# Altium schematic sheet 1_Sch.SchDoc
size A4; SheetNumber: 1; SheetTotal: 1
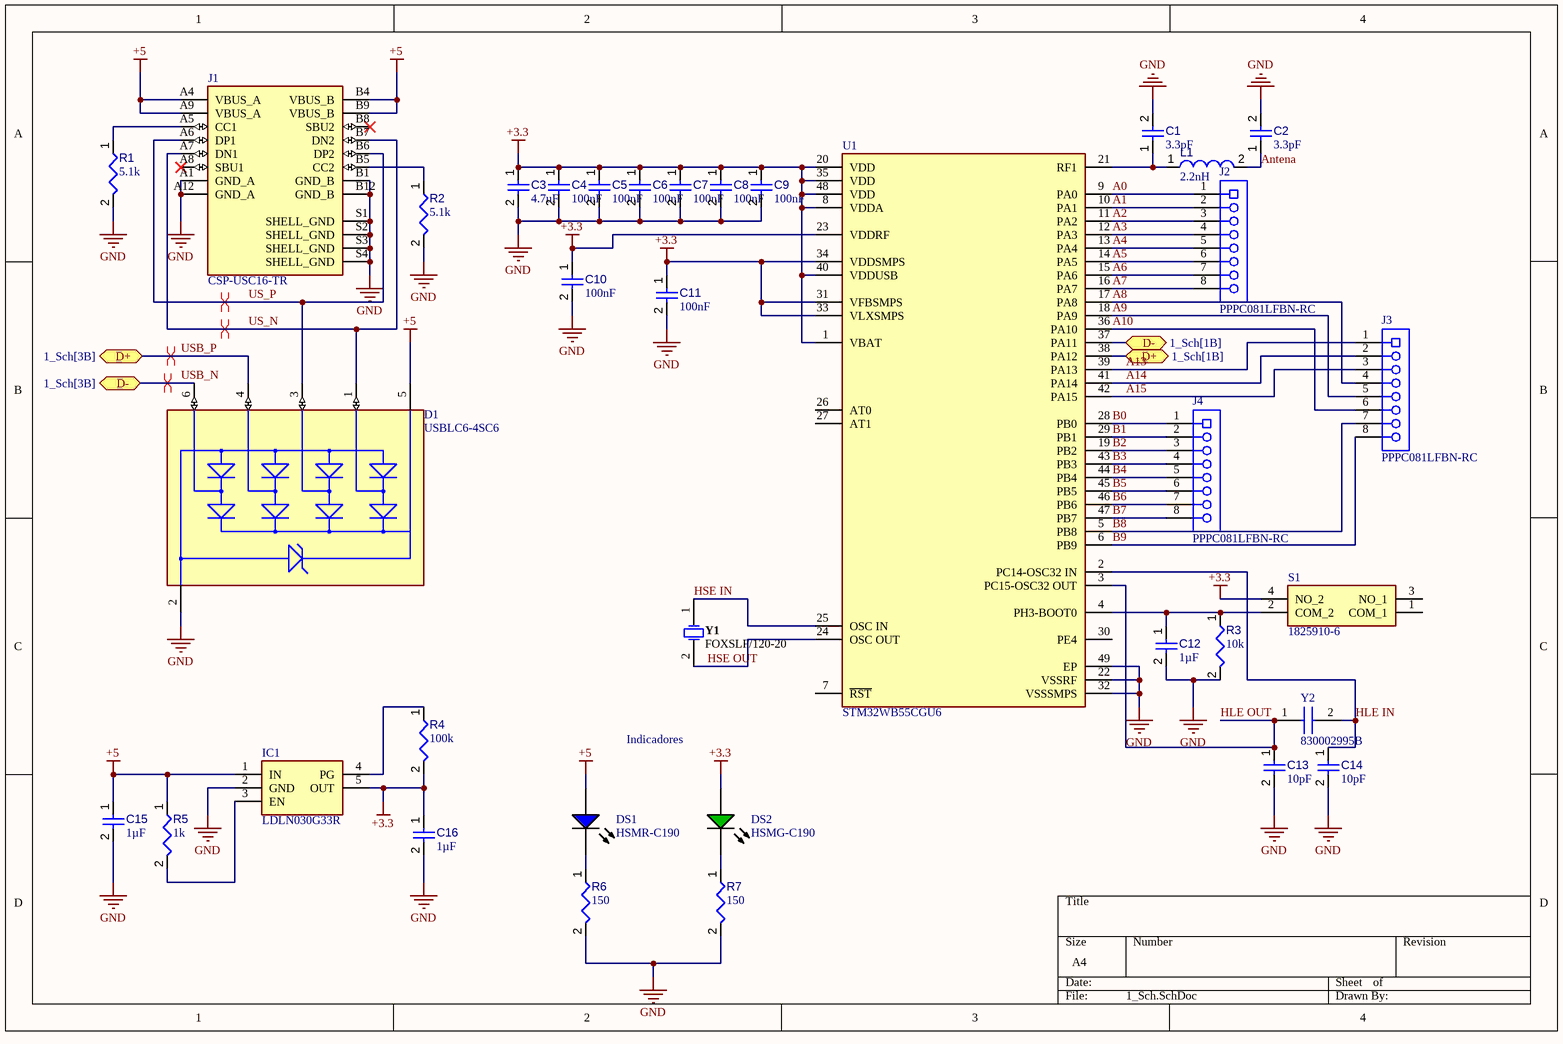
[diagram p0: 1_Sch.SchDoc]

## Parts
C1  value 3.3pF  [CAPC1608X90X40NL10T20]  (hidden comment: Capacitor 100 nF +/-10% 50 V 0603)
C2  value 3.3pF  [CAPC1608X90X40NL10T20]  (hidden comment: Capacitor 100 nF +/-10% 50 V 0603)
C3  value 4.7uF  [CAPC1608X90X40NL10T20]  (hidden comment: Capacitor 100 nF +/-10% 50 V 0603)
C4  value 100nF  [CAPC1608X90X40NL10T20]  (hidden comment: Capacitor 100 nF +/-10% 50 V 0603)
C5  value 100nF  [CAPC1608X90X40NL10T20]  (hidden comment: Capacitor 100 nF +/-10% 50 V 0603)
C6  value 100nF  [CAPC1608X90X40NL10T20]  (hidden comment: Capacitor 100 nF +/-10% 50 V 0603)
C7  value 100nF  [CAPC1608X90X40NL10T20]  (hidden comment: Capacitor 100 nF +/-10% 50 V 0603)
C8  value 100nF  [CAPC1608X90X40NL10T20]  (hidden comment: Capacitor 100 nF +/-10% 50 V 0603)
C9  value 100nF  [CAPC1608X90X40NL10T20]  (hidden comment: Capacitor 100 nF +/-10% 50 V 0603)
C10  value 100nF  [CAPC1608X90X40NL10T20]  (hidden comment: Capacitor 100 nF +/-10% 50 V 0603)
C11  value 100nF  [CAPC1608X90X40NL10T20]  (hidden comment: Capacitor 100 nF +/-10% 50 V 0603)
C12  value 1µF  [CAPC1608X94X35NL15T15]  (hidden comment: Capacitor 1 uF +/- 10% 16 V 0603)
C13  value 10pF  [CAPC1608X90X40ML10T20]  (hidden comment: Capacitor 10 pF +/- 5% 50 V 0603)
C14  value 10pF  [CAPC1608X90X40ML10T20]  (hidden comment: Capacitor 10 pF +/- 5% 50 V 0603)
C15  value 1µF  [CAPC1608X90X35ML15T15]  (hidden comment: Capacitor 1uF +/- 10% 16V 0603)
C16  value 1µF  [CAPC1608X90X35ML15T15]  (hidden comment: Capacitor 1uF +/- 10% 16V 0603)
D1  USBLC6-4SC6  [FP-SOT23-6L-MFG]
DS1  HSMR-C190  [AVAG-HSMX-C190_V]
DS2  HSMG-C190  [AVAG-HSMX-C190_V]
IC1  LDLN030G33R  [SOT95P280X100-5N]
J1  CSP-USC16-TR  [VALCON_CSP-USC16-TR]
J2  PPPC081LFBN-RC  [SLIN-PPPC081LFBN-RC_V]
J3  PPPC081LFBN-RC  [SLIN-PPPC081LFBN-RC_V]
J4  PPPC081LFBN-RC  [SLIN-PPPC081LFBN-RC_V]
L1  value 2.2nH  [IND1005X55X20VL5T10]  (hidden comment: ELJ-RF2N2DFB)
R1  value 5.1k  [RESC1608X55X25ML10T15]  (hidden comment: Resistor 1k +/-1% 0603 100 mW)
R2  value 5.1k  [RESC1608X55X25ML10T15]  (hidden comment: Resistor 1k +/-1% 0603 100 mW)
R3  value 10k  [RESC1608X55X25ML10T15]  (hidden comment: Resistor 10k +/-1% 0603 100 mW)
R4  value 100k  [RESC1608X55X25ML10T15]  (hidden comment: Resistor 100k +/-1% 0603 100 mW)
R5  value 1k  [RESC1608X55X25ML10T15]  (hidden comment: Resistor 1k +/-1% 0603 100 mW)
R6  value 150  [RESC1608X55X25ML10T15]  (hidden comment: Resistor 1k +/-1% 0603 100 mW)
R7  value 150  [RESC1608X55X25ML10T15]  (hidden comment: Resistor 1k +/-1% 0603 100 mW)
S1  1825910-6  [18259106]
U1  STM32WB55CGU6  [FP-STM32WB55CGU6-MFG]
Y1  FOXSLF/120-20  [FOX-FOXSLF-2_V]
Y2  830002995B  [830002995B]

## Ports
D+ (bidir, see 1_Sch[1B]), D+ (bidir, see 1_Sch[3B]), D- (bidir, see 1_Sch[1B]), D- (bidir, see 1_Sch[3B])

## Nets
+3.3: C3.1 C4.1 C5.1 C6.1 C7.1 C8.1 C9.1 C10.1 C11.1 C16.1 DS2.1(A) IC1.5(OUT) R4.2 S1.4(NO_2) U1.1(VBAT) U1.8(VDDA) U1.20(VDD) U1.23(VDDRF) U1.31(VFBSMPS) U1.33(VLXSMPS) U1.34(VDDSMPS) U1.35(VDD) U1.40(VDDUSB) U1.48(VDD)
+5: C15.1 D1.5(VBUS) DS1.1(A) IC1.1(IN) J1.A4(VBUS_A) J1.A9(VBUS_A) J1.B4(VBUS_B) J1.B9(VBUS_B) R5.1
GND: C1.2 C2.2 C3.2 C4.2 C5.2 C6.2 C7.2 C8.2 C9.2 C10.2 C11.2 C12.2 C13.2 C14.2 C15.2 C16.2 D1.2(GND) IC1.2(GND) J1.A1(GND_A) J1.A12(GND_A) J1.B1(GND_B) J1.B12(GND_B) J1.S1(SHELL_GND) J1.S2(SHELL_GND) J1.S3(SHELL_GND) J1.S4(SHELL_GND) R1.2 R2.2 R3.2 R6.2 R7.2 U1.22(VSSRF) U1.32(VSSSMPS) U1.49(EP)
A0: J2.1 U1.9(PA0)
A1: J2.2 U1.10(PA1)
A2: J2.3 U1.11(PA2)
A3: J2.4 U1.12(PA3)
A4: J2.5 U1.13(PA4)
A5: J2.6 U1.14(PA5)
A6: J2.7 U1.15(PA6)
A7: J2.8 U1.16(PA7)
A8: J3.4 U1.17(PA8)
A9: J3.5 U1.18(PA9)
A10: J3.6 U1.36(PA10)
A13: J3.1 U1.39(PA13)
A14: J3.2 U1.41(PA14)
A15: J3.3 U1.42(PA15)
Antena: C2.1 L1.2
B0: J4.1 U1.28(PB0)
B1: J4.2 U1.29(PB1)
B2: J4.3 U1.19(PB2)
B3: J4.4 U1.43(PB3)
B4: J4.5 U1.44(PB4)
B5: J4.6 U1.45(PB5)
B6: J4.7 U1.46(PB6)
B7: J4.8 U1.47(PB7)
B8: J3.7 U1.5(PB8)
B9: J3.8 U1.6(PB9)
HLE IN: C14.1 U1.2(PC14-OSC32_IN) Y2.2(CRYSTAL_2)
HLE OUT: C13.1 U1.3(PC15-OSC32_OUT) Y2.1(CRYSTAL_1)
HSE IN: U1.25(OSC_IN) Y1.1
HSE OUT: U1.24(OSC_OUT) Y1.2
US_N: D1.1(I/O1) J1.A7(DN1) J1.B7(DN2)
US_P: D1.3(I/O2) J1.A6(DP1) J1.B6(DP2)
USB_N: D1.6(I/O4) U1.37(PA11) ; port D-
USB_P: D1.4(I/O3) U1.38(PA12) ; port D+
NetC1_1: C1.1 L1.1 U1.21(RF1)
NetC12_1: C12.1 R3.1 S1.2(COM_2) U1.4(PH3-BOOT0)
NetDS1_2: DS1.2(K) R6.1
NetDS2_2: DS2.2(K) R7.1
NetIC1_3: IC1.3(EN) R5.2
NetIC1_4: IC1.4(PG) R4.1
NetJ1_A5: J1.A5(CC1) R1.1
NetJ1_B5: J1.B5(CC2) R2.1

Not connected (* = marked no-connect by the designer): J1 A8(SBU1)* B8(SBU2)*; S1 1(COM_1) 3(NO_1); U1 7(~{RST}) 26(AT0) 27(AT1) 30(PE4)

## Layout directives
differential pair; differential pair class USB: US_N, US_P
differential pair: USB_N, USB_P

## Notes on the sheet
- Indicadores

## Library data of the parts
C1-C11 = CMP-001-00017-6: Chip Capacitor, 100 nF, +/- 10%, 50 V, 0603 (1608 Metric); Voltage Rating: 50V; Capacitor Type: Ceramic; Tolerance: 10%; Mounting Technology: SM; Max Operating Temperature: 125°C; RoHS Compliant: True; Pins: 2; Case/Package: 0603; Min Operating Temperature: -55°C
C12 = CMP-001-00003-6: Chip Capacitor, 1 uF, +/- 10%, 16 V, 0603 (1608 Metric); Voltage Rating: 16V; Capacitor Type: Ceramic; Max Operating Temperature: 125°C; Pins: 2; Tolerance: 10%; Min Operating Temperature: -55°C; RoHS Compliant: True; Mounting Technology: SM; Case/Package: 0603
C13 C14 = CMP-001-00014-6: Chip Capacitor, 10 pF, +/- 5%, 50 V, 0603 (1608 Metric); Capacitor Type: Ceramic; Voltage Rating: 50V; RoHS Compliant: True; Case/Package: 0603; Max Operating Temperature: 125°C; Pins: 2; Tolerance: 5%; Mounting Technology: SM; Min Operating Temperature: -55°C
C15 C16 = CMP-001-00004-6: Chip Capacitor, 1 uF, +/- 10%, 16 V, 0603 (1608 Metric); Capacitor Type: Ceramic; Mounting Technology: SM; RoHS Compliant: True; Min Operating Temperature: -55°C; Case/Package: 0603; Pins: 2; Voltage Rating: 16V; Max Operating Temperature: 125°C; Tolerance: 10%
D1 = CMP-2000-07370-2: TVS DIODE 5.25V 17V SOT23-6; Manufacturer: STMicroelectronics; Peak Pulse Power: 130W; Breakdown Voltage: 6V; Value: 3pF; Direction: Unidirectional; Interface: USB,Ethernet,Other; Number Of Channels: 4; Standoff Height: 0mm; Max Junction Temp: +125°C; Digikey Description: TVS DIODE 5.25V 17V SOT23-6; Automotive: No; Package: SOT23-6L; Mouser Description: USBLC6 Series 4 Line 6 V Uni / Bi-Directional ESD Protection - SOT-23-6; Octopart: https://octopart.com/usblc6-4sc6-stmicroelectronics-347147; RoHS: TRUE; ComponentLink2URL: https://upverter.com/datasheet/23dc4ffb028d868909e80577610284b194f13213.pdf; ComponentLink2Description: Datasheet; Device Class L1: Circuit Protection; Lead Free: Yes; Temperature Range High: +125°C; Device Class L2: ESD and Circuit Protection ICs; Device Class L3: unset; Capacitance: 3pF; Height: 1.45mm; Temperature Range Low: -40°C; Manufacturer Part Number: USBLC6-4SC6; Temperature: -40°C to +125°C; Category: Diode; Clamping Voltage: 17V
DS1 = CMP-007-00015-2: LED Uni-Color Blue, 78 mW, 20 mA, -40 to 85 degC, 2-Pin SMD, RoHS, Tape and Reel; Manufacturer: Avago; Forward Voltage: 3.4V; Power: 78mW; Forward Current: 20mA; Luminous Intensity: 55mcd; Lens Style: Diffused; Viewing Angle: 155degrees; Pins: 2; Max Operating Temperature: 85°C; Colour: Blue; Datasheet Version: Apr-10; RoHS Compliant: True; Mounting Technology: SM; Min Operating Temperature: -40°C; Illumination Colour: Blue; Package Quantity: 4000; Datasheet URL: http://docs.avagotech.com/docs/AV02-0977EN; Package Reference: HSMX-C190; Packaging: TapeandReel; Nominal Vf: 3.4V; Case/Package: 0603; Package Description: 2-Pin Surface Mount Device, Body 1.6 x 0.8 mm, Height 0.9 mm; Manufacturer URL: http://www.avagotech.com/
DS2 = CMP-007-00013-2: LED Uni-Color Green, 52 mW, 20 mA, -40 to 85 degC, 2-Pin SMD, RoHS, Tape and Reel; Manufacturer: Avago; Forward Current: 20mA; Viewing Angle: 170degrees; Luminous Intensity: 15mcd; Lens Style: Diffused; Forward Voltage: 2.2V; Power: 52mW; Mounting Technology: SM; RoHS Compliant: True; Packaging: TapeandReel; Illumination Colour: Green; Datasheet URL: http://docs.avagotech.com/docs/AV02-0551EN; Min Operating Temperature: -40°C; Max Operating Temperature: 85°C; Pins: 2; Package Description: 2-Pin Surface Mount Device, Body 1.6 x 0.8 mm, Height 0.9 mm; Nominal Vf: 2.2V; Case/Package: 0603; Manufacturer URL: http://www.avagotech.com/; Datasheet Version: Mar-12; Colour: Green; Package Reference: HSMX-C190; Package Quantity: 4000
IC1 = LDLN030G33R: Integrated Circuit; Manufacturer_Name: STMicroelectronics; Datasheet Link: https://www.st.com/resource/en/datasheet/ldln030.pdf; Height: 1mm; Manufacturer_Part_Number: LDLN030G33R; Mouser Part Number: 511-LDLN030G33R; Mouser Price/Stock: https://www.mouser.co.uk/ProductDetail/STMicroelectronics/LDLN030G33R?qs=lYGu3FyN48e7Uzo%2F%252BerwZg%3D%3D; Arrow Part Number: LDLN030G33R; Arrow Price/Stock: https://www.arrow.com/en/products/ldln030g33r/stmicroelectronics?region=nac
J1 = CMP-002-00071-1: CSP-USC16-TR Valcon USB Type C Surface Mount PCB Socket; Design Item ID: CSP-USC16-TR; Value: *; Source: CSP-USC16-TR.SchLib; Availability: In Stock; Pins: 20; Case/Package: None; Price: None; MF: Valcon; Component Type: Standard; Check_prices: https://www.snapeda.com/parts/CSP-USC16-TR/Valcon/view-part/?ref=eda; SnapEDA_Link: https://www.snapeda.com/parts/CSP-USC16-TR/Valcon/view-part/?ref=snap; Purchase-URL: https://pricing.snapeda.com/search/part/CSP-USC16-TR/?ref=eda; MP: CSP-USC16-TR
J2-J4 = CMP-002-00028-2: Female Header, Pitch 2.54 mm, 1 x 8 Position, Height 8.5 mm, Tail Length 3.2 mm, -40 to 105 degC, RoHS, Bulk; Manufacturer: Sullins; Package Reference: PPPC081LFBN-RC; Connector Type: Header; Datasheet Version: Jan-15; Package Description: Female Header, Pitch 2.54 mm, 1 x 8 Position, Height 8.5 mm, Tail Length 3.2 mm; RoHS Compliant: Unknown; Max Operating Temperature: 105°C; Case/Package: PPPC081LFBN-RC; Min Operating Temperature: -40°C; Datasheet URL: http://sullinscorp.com/catalogs/101_PAGE114-115_.100_FEMALE_HDR.pdf; Gender: Female; Mounting Technology: TH
L1 = CMP-006-00006-6: Chip Inductor, 2.2 nH, +/- 0.3 nH, 400 mA, -40 to 85 degC, 0402 (1005 Metric), RoHS, Tape and Reel; Manufacturer: Panasonic; Shielding: Unshielded; Current Rating: 400mA; Tolerance: 5%; Core Material: Ceramic; Q Factor: 8; Datasheet URL: http://www.bourns.com/docs/Product-Datasheets/cm322522.pdf; Case/Package: 0402; RoHS Compliant: True; Package Description: 2-Pin Surface Mount Device, Body 1 x 0.5 mm; Packaging: TapeandReel; Datasheet Version: Sep-12; Package Quantity: 10000; Package Reference: 0402; Min Operating Temperature: -20°C; Mounting Technology: SM; Max Operating Temperature: 85°C
R1 R2 R5-R7 = CMP-009-00014-5: Chip Resistor, 1 KOhm, +/-1%, 0.1 W, -55 to 155 degC, 0603 (1608 Metric); Voltage Rating: 50V; Power: 100mW; Tolerance: 1%; Mounting Technology: SM; Pins: 2; Case/Package: 0603; Min Operating Temperature: -55°C; RoHS Compliant: True; Max Operating Temperature: 155°C
R3 = CMP-009-00017-5: Chip Resistor, 10 KOhm, +/- 1%, 01 W, -55 to 155 degC, 0603 (1608 Metric); Voltage Rating: 50V; Power: 100mW; RoHS Compliant: True; Min Operating Temperature: -55°C; Pins: 2; Case/Package: 0603; Mounting Technology: SM; Max Operating Temperature: 155°C; Tolerance: 1%
R4 = CMP-009-00023-5: Chip Resistor, 100 KOhm, +/- 1%, 0.1 W, -55 to 155 degC, 0603 (1608 Metric); Voltage Rating: 50V; Power: 100mW; Max Operating Temperature: 155°C; RoHS Compliant: True; Tolerance: 1%; Pins: 2; Case/Package: 0603; Mounting Technology: SM; Min Operating Temperature: -55°C
S1 = 1825910-6: Switch; Manufacturer_Name: TE Connectivity; Datasheet Link: https://www.te.com/commerce/DocumentDelivery/DDEController?Action=srchrtrv&DocNm=1825910&DocType=Customer+Drawing&DocLang=English&DocFormat=pdf&PartCntxt=1825910-6; Height: 5.3mm; Manufacturer_Part_Number: 1825910-6; Mouser Part Number: N/A; Mouser Price/Stock: https://www.mouser.co.uk/ProductDetail/TE-Connectivity/1825910-6?qs=A6cQTCBcXncisYDS1KbpGA%3D%3D; Arrow Part Number: 1825910-6; Arrow Price/Stock: https://www.arrow.com/en/products/1825910-6/te-connectivity?region=europe
U1 = CMP-12105-000013-1: ULTRA-LOW-POWER DUAL CORE ARM CO; Manufacturer: STMicroelectronics; Number Of Cores: 1; Number Of I2C Channels: 2; Interface: I2C,SPI,UART,USART,2-Wire,USB,IrDA,Other; Core Architecture: ARM Cortex-M4; Data Bus Width: 32bits; Memory Size: 1MBytes; Number Of Pwm Channels: 14; Max Supply Voltage: 3.6V; Standoff Height: 0mm; Number Of Timers/Counters: 6; Frequency: 64MHz; Max Junction Temp: +105°C; Number Of I/Os: 30; Min Supply Voltage: 1.71V; Number Of Adc Channels: 13; Ram Size: 256KBytes; Memory Type: FLASH; Octopart: https://octopart.com/stm32wb55cgu6-stmicroelectronics-98750847; Temperature Range High: +105°C; RoHS: TRUE; Number Of Spi Channels: 1; Category: IC; Device Class L1: Integrated Circuits (ICs); Lead Free: Yes; Height: 0.65mm; Number Of A/D Converters: 1; Package: UFQFPN48; Number Of Usb Channels: 1; Number Of Uart Channels: 2; Temperature Range Low: -40°C; Ambient Temperature Range Low: -40°C; Device Class L3: Microcontrollers; Manufacturer Part Number: STM32WB55CGU6; Temperature: -40°C to +105°C; ComponentLink2URL: https://www.st.com/resource/en/datasheet/stm32wb55cg.pdf; Device Class L2: Embedded Processors and Controllers; Digikey Description: ULTRA-LOW-POWER DUAL CORE ARM CO; ComponentLink2Description: Datasheet; Ambient Temperature Range High: +85°C; Automotive: No
Y1 = CMP-003-00026-2: Resistance Weld Thru-Hole Crystal, 12 MHz, +/-30 ppm, 20 pF, -20 to 70 degC, 2-Pin THD, RoHS, Bulk; Manufacturer: FOX Electronics; ESR: 60; Resistance: 60Ohm; Frequency Tolerance: 30ppm; Load Capacitance: 20pF; Frequency: 12MHz; Tolerance: 50ppm; Max Operating Temperature: 70°C; Case/Package: FOXSLF-2; Datasheet Version: Mar-15; Mounting Technology: TH; Package Quantity: 100; Package Description: 2-Pin Through Hole Device, Body 11.35 x 4.65 mm, Pitch 4.88 mm; Packaging: Bulk; Package Reference: FOXSLF-2; RoHS Compliant: True; Pins: 2; Datasheet URL: http://www.foxonline.com/pdfs/hc49slf.pdf; Manufacturer URL: http://www.foxonline.com/; Min Operating Temperature: -20°C
Y2 = 830002995B: Capacitor; Manufacturer_Name: Wurth Elektronik; Datasheet Link: https://www.mouser.de/datasheet/2/445/830002995B-2005217.pdf; Height: 8.2mm; Manufacturer_Part_Number: 830002995B; Mouser Part Number: 710-830002995B; Mouser Price/Stock: https://www.mouser.co.uk/ProductDetail/Wurth-Elektronik/830002995B?qs=2WXlatMagcHCnw26vHVZcg%3D%3D